# Altium project jlink.PrjPCB
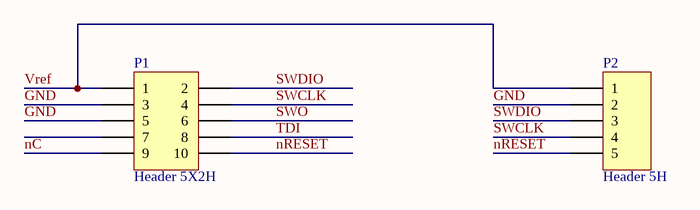
[diagram p0: jlinker.SchDoc]
1 sheet, 2 parts. Net scope: global (net labels, ports and power ports of the same name join across sheets).
Board file: jlinker.PcbDoc

## Sheet jlinker.SchDoc
size E

### Parts
P1  Header 5X2H  [MHDR2X5]
P2  Header 5H  [HDR1X5]

### Nets
GND: P1.3 P1.5 P2.2
nC: P1.9
nRESET: P1.10 P2.5
SWCLK: P1.4 P2.4
SWDIO: P1.2 P2.3
SWO: P1.6
TDI: P1.8
Vref: P1.1 P2.1

Not connected (* = marked no-connect by the designer): P1 7

### Notes on the sheet
- Title
- Size:
- Date:
- File:
- E
- Number:
- Time:
- Revision:
- Sheet
- of

### Library data of the parts
P1 = Header 5X2H: Header, 5-Pin, Dual row, Right Angle; LatestRevisionDate: 17-Jul-2002; LatestRevisionNote: Re-released for DXP Platform.; Publisher: Altium Limited
P2 = Header 5H: Header, 5-Pin, Right Angle; LatestRevisionDate: 17-Jul-2002; LatestRevisionNote: Re-released for DXP Platform.; Publisher: Altium Limited